# EAGLE schematic groovy (EAGLE 9.0.1)

## Sheet 1 of 2
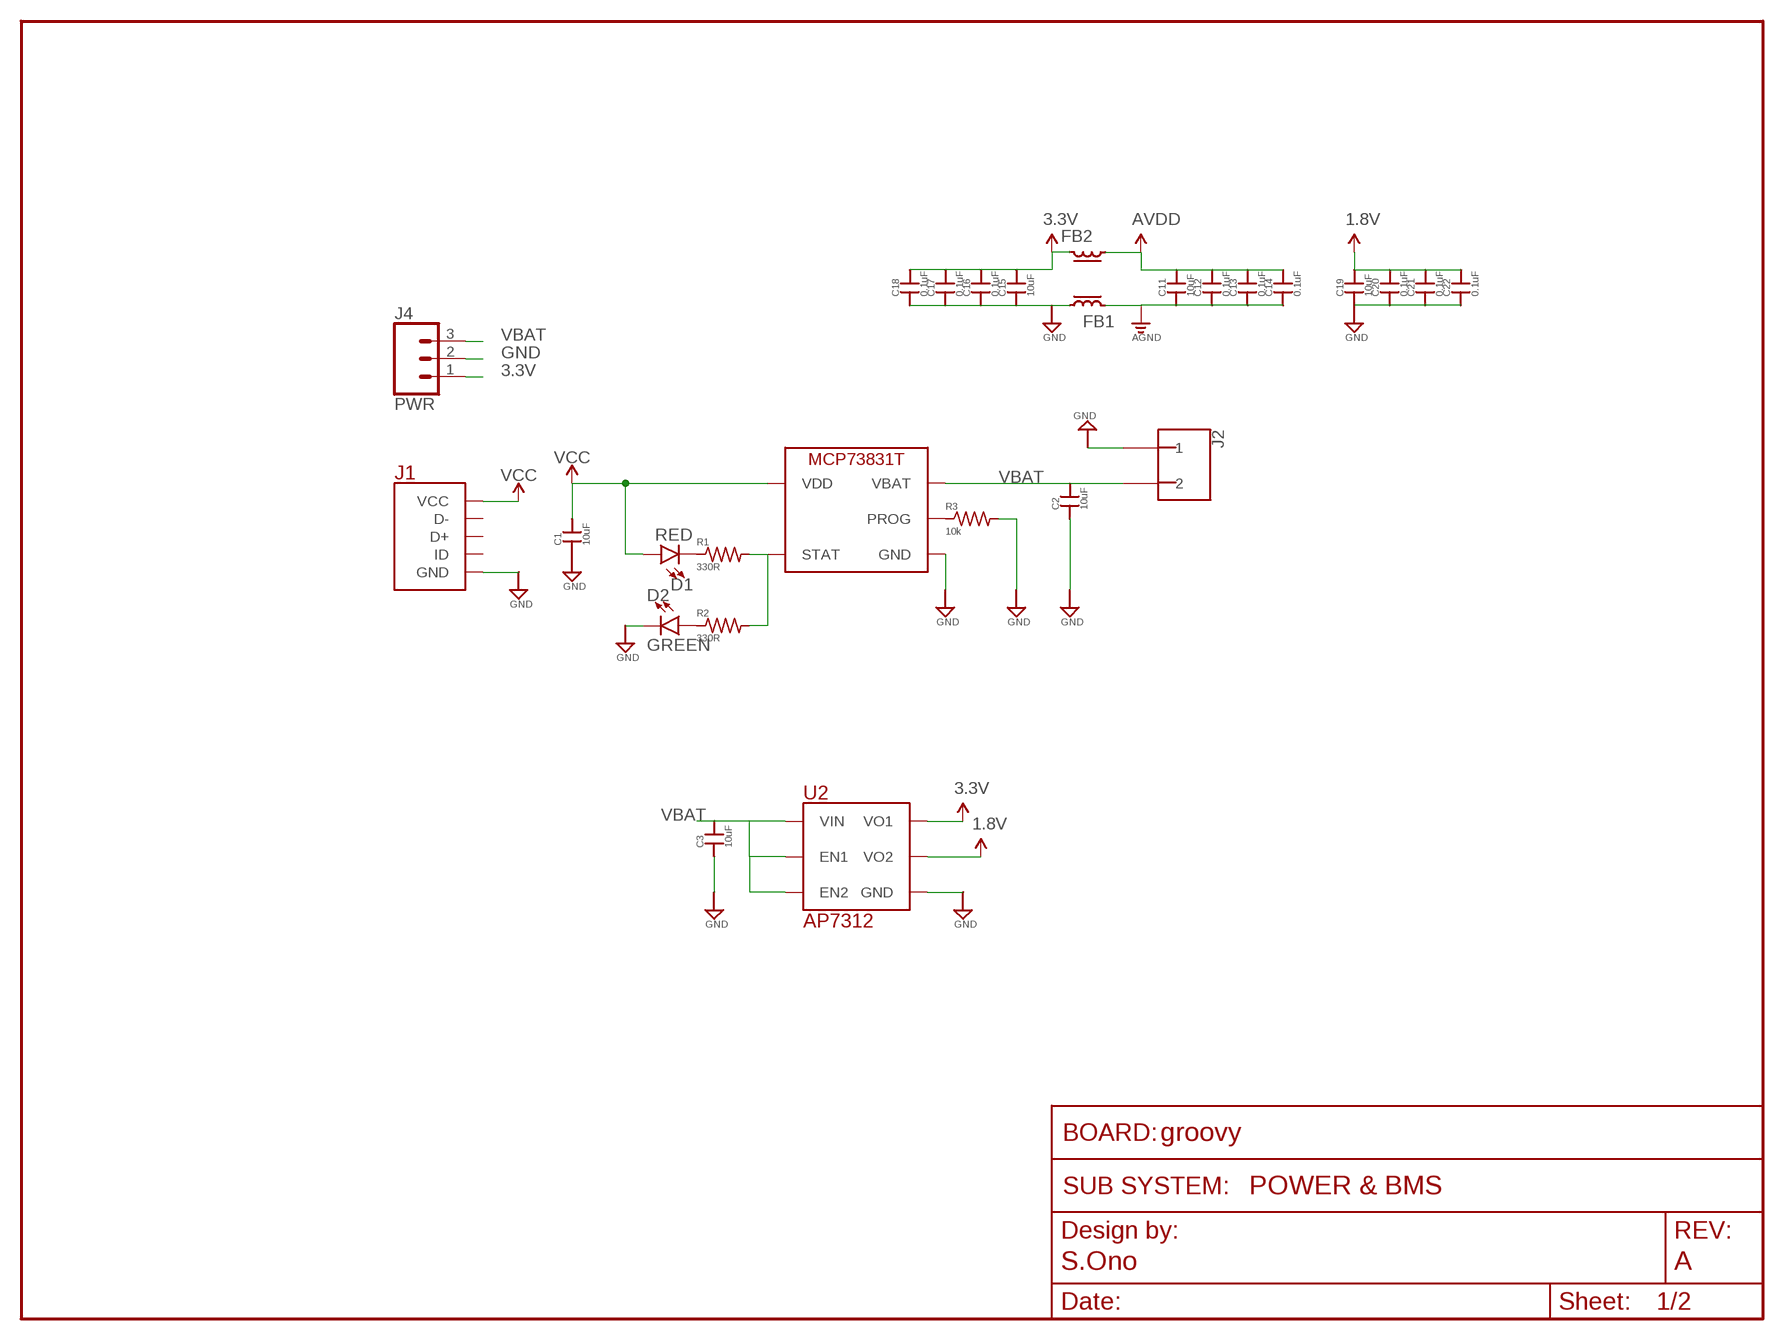
[diagram p0: schematic, sheet 1]
FRAME1 (FRAME_SCHEMATIC): AUTHOR: S.Ono; REV: A; SUBSYSTEM_NAME: POWER & BMS

### Parts
C1  10uF  CAP0402-CAP  [0402-CAP]
C2  10uF  CAP0402-CAP  [0402-CAP]
C3  10uF  CAP0402-CAP  [0402-CAP]
C11  10uF  CAP0402-CAP  [0402-CAP]
C12  0.1uF  CAP0402-CAP  [0402-CAP]
C13  0.1uF  CAP0402-CAP  [0402-CAP]
C14  0.1uF  CAP0402-CAP  [0402-CAP]
C15  10uF  CAP0402-CAP  [0402-CAP]
C16  0.1uF  CAP0402-CAP  [0402-CAP]
C17  0.1uF  CAP0402-CAP  [0402-CAP]
C18  0.1uF  CAP0402-CAP  [0402-CAP]
C19  10uF  CAP0402-CAP  [0402-CAP]
C20  0.1uF  CAP0402-CAP  [0402-CAP]
C21  0.1uF  CAP0402-CAP  [0402-CAP]
C22  0.1uF  CAP0402-CAP  [0402-CAP]
D1  RED  LED0603  [LED-0603]
D2  GREEN  LED0603  [LED-0603]
FB1  FERRITE  [0603-FERR]
FB2  FERRITE  [0603-FERR]
J1  USB_MICRO  [USB_MICRO]
J2  2_PIN_JST-XH  [2_PIN_JST-XH]
J4  PWR  CONN_03  [1X03]
R1  330R  R-US_R0603  [R0603]
R2  330R  R-US_R0603  [R0603]
R3  10k  R-US_R0603  [R0603]
U1  MCP73831T  [SOT23-5]
U2  AP7312-1833  [6-SOT]

### Nets
1.8V: C19.2 C20.2 C21.2 C22.2 U2.1(VO2) ; also sheet 2
3.3V: C15.2 C16.2 C17.2 C18.2 FB2.2 J4.1 U2.6(VO1) ; also sheet 2
AGND: C11.1 C12.1 C13.1 C14.1 FB1.2 ; also sheet 2
AVDD: C11.2 C12.2 C13.2 C14.2 FB2.1 ; also sheet 2
GND: C1.1 C2.1 C3.1 C15.1 C16.1 C17.1 C18.1 C19.1 C20.1 C21.1 C22.1 D2.C FB1.1 J1.GND J2.P$1 J4.2 R3.2 U1.2(GND) U2.2(GND) ; also sheet 2
N$1: D1.C R1.1
N$2: D2.A R2.1
N$4: R1.2 R2.2 U1.1(STAT)
N$5: R3.1 U1.5(PROG)
VBAT: C2.2 C3.2 J2.P$2 J4.3 U1.3(VBAT) U2.3(EN2) U2.4(EN1) U2.5(VIN)
VCC: C1.2 D1.A J1.VCC U1.4(VDD)
Unconnected: J1.D+ J1.D- J1.ID

## Sheet 2 of 2
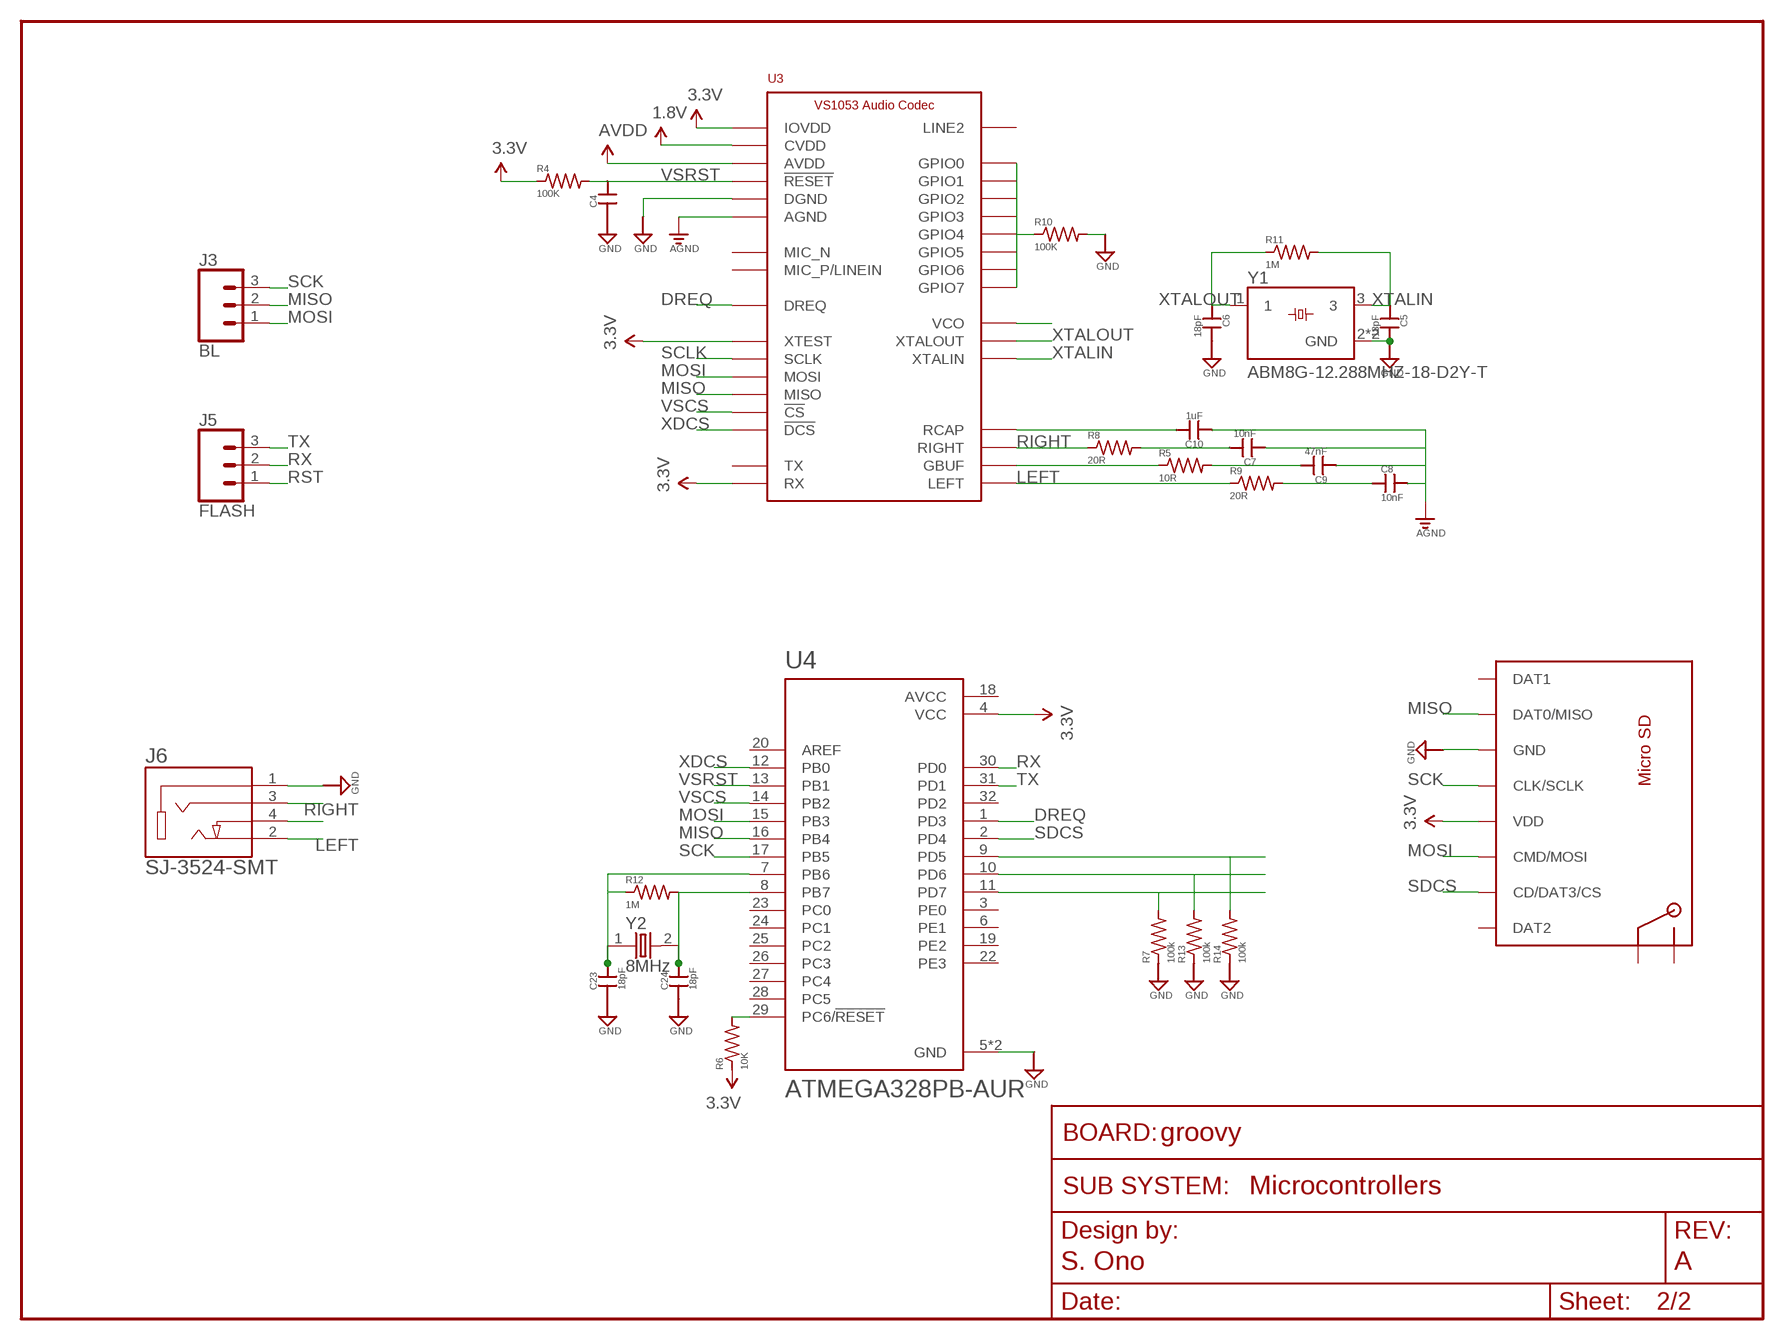
[diagram p1: schematic, sheet 2]
FRAME2 (FRAME_SCHEMATIC): AUTHOR: S. Ono; REV: A; SUBSYSTEM_NAME: Microcontrollers

### Parts
C4  CAP0603-CAP  [0603-CAP]
C5  18pF  CAP0603-CAP  [0603-CAP]
C6  18pF  CAP0603-CAP  [0603-CAP]
C7  10nF  CAP0603-CAP  [0603-CAP]
C8  10nF  CAP0603-CAP  [0603-CAP]
C9  47nF  CAP0603-CAP  [0603-CAP]
C10  1uF  CAP0603-CAP  [0603-CAP]
C23  18pF  CAP0603-CAP  [0603-CAP]
C24  18pF  CAP0603-CAP  [0603-CAP]
J3  BL  CONN_03  [1X03]
J5  FLASH  CONN_03  [1X03]
J6  SJ-3524-SMT  [CUI_SJ-3524-SMT]
P1  MICROSD  [MICROSD]
R4  100K  R-US_R0603  [R0603]
R5  10R  R-US_R0603  [R0603]
R6  10K  R-US_R0603  [R0603]
R7  100k  R-US_R0603  [R0603]
R8  20R  R-US_R0603  [R0603]
R9  20R  R-US_R0603  [R0603]
R10  100K  R-US_R0603  [R0603]
R11  1M  R-US_R0603  [R0603]
R12  1M  R-US_R0603  [R0603]
R13  100k  R-US_R0603  [R0603]
R14  100k  R-US_R0603  [R0603]
U3  VS1053  [QFP50P900X900X120-48N]
U4  ATMEGA328PB-AUR  [QFP80P900X900X120-32N]
Y1  ABM8G-12.288MHZ-18-D2Y-T  [OSCSC320X250X100N]
Y2  8MHz  ABM3-8.000MHZ-D2Y-T  [XTAL500X320X130N]

### Nets
1.8V: U3.5(CVDD) U3.7(CVDD) U3.24(CVDD) U3.31(CVDD) ; also sheet 1
3.3V: P1.4(VDD) R4.1 R6.1 U3.6(IOVDD) U3.14(IOVDD) U3.19(IOVDD) U3.26(RX) U3.32(XTEST) U4.4(VCC) ; also sheet 1
AGND: C7.1 C8.2 C9.1 C10.1 U3.37(AGND) U3.40(AGND) U3.41(AGND) U3.47(AGND) ; also sheet 1
AVDD: U3.38(AVDD) U3.43(AVDD) U3.45(AVDD) ; also sheet 1
DREQ: U3.8(DREQ) U4.1(PD3)
GBUF: R5.1 U3.42(GBUF)
GND: C4.1 C5.2 C6.2 C23.1 C24.1 J6.1 P1.6(GND) R7.1 R10.2 R13.1 R14.1 U3.4(DGND) U3.16(DGND) U3.20(DGND) U3.21(DGND) U3.22(DGND) U3.35(DGND) U4.5(GND) U4.21(GND) Y1.2(GND) Y1.4(GND) ; also sheet 1
LEFT: J6.2 R9.1 U3.46(LEFT)
MISO: J3.2 P1.7(DAT0/MISO) U3.30(MISO) U4.16(PB4)
MOSI: J3.1 P1.3(CMD/MOSI) U3.29(MOSI) U4.15(PB3)
N$3: C7.2 R8.2
N$6: C23.2 R12.1 U4.7(PB6) Y2.1
N$7: R7.2 U4.11(PD7)
N$8: C24.2 R12.2 U4.8(PB7) Y2.2
N$9: R13.2 U4.10(PD6)
N$10: J6.4
N$11: R14.2 U4.9(PD5)
N$23: U3.15(VCO)
N$24: C9.2 R5.2
N$25: C8.1 R9.2
N$27: R10.1 U3.9(GPIO2) U3.10(GPIO3) U3.11(GPIO6) U3.12(GPIO7) U3.25(GPIO5) U3.33(GPIO0) U3.34(GPIO1) U3.36(GPIO4)
RCAP: C10.2 U3.44(RCAP)
RIGHT: J6.3 R8.1 U3.39(RIGHT)
RST: J5.1 R6.2 U4.29(PC6/!RESET)
RX: J5.2 U4.30(PD0)
SCK: J3.3 P1.5(CLK/SCLK) U4.17(PB5)
SCLK: U3.28(SCLK)
SDCS: P1.2(CD/DAT3/CS) U4.2(PD4)
TX: J5.3 U4.31(PD1)
VSCS: U3.23(!CS!) U4.14(PB2)
VSRST: C4.2 R4.2 U3.3(!RESET!) U4.13(PB1)
XDCS: U3.13(!DCS!) U4.12(PB0)
XTALIN: C5.1 R11.2 U3.18(XTALIN) Y1.3
XTALOUT: C6.1 R11.1 U3.17(XTALOUT) Y1.1
Unconnected: P1.1(DAT2) P1.8(DAT1) P1.DETECT1(DET0) P1.DETECT2(DET1) U3.1(MIC_P/LINEIN) U3.2(MIC_N) U3.27(TX) U3.48(LINE2) U4.3(PE0) U4.6(PE1) U4.19(PE2) U4.20(AREF) U4.22(PE3) U4.23(PC0) U4.24(PC1) U4.25(PC2) U4.26(PC3) U4.27(PC4) U4.28(PC5) U4.32(PD2)

## Power pins joined to a net without a drawn wire
AVCC: U4.18(AVCC)

## Library data of the parts
C1-C24 = scono:CAP: Capacitor Standard 0603 ceramic capacitor, and 0.1" leaded capacitor.; PIE-INT-REF-NUM: CAPACITOR-GENERIC
D1 D2 = scono:LED: https://www.digikey.com/products/en/optoelectronics/led-indication-discrete/105?k=&pkeyword=&pv7=2&pv1989=0&pv16=5&FV=ffe00069&quantity=0&ColumnSort=0&page=1&pageSize=25
FB1 FB2 = scono:FERRITE: https://www.digikey.com/product-detail/en/wurth-electronics-inc/742792651/732-1593-1-ND/1639537
J1 = scono:USB_MICRO: https://www.digikey.com/product-detail/en/molex-llc/0475890001/WM17143CT-ND/1832255
J2 = scono:2_PIN_JST-XH: https://www.digikey.com/product-detail/en/jst-sales-america-inc/B2B-XH-A(LF)(SN)/455-2247-ND/1651045
J3-J5 = scono:CONN_03: Multi connection point. Often used as Generic Header-pin footprint for 0.1 inch spaced/style header connections On any of the 0.1 inch spaced packages, you can populate with these: Break Away Headers - Straight <https://www.sparkfun.com/products/116> (PRT-00116) Break Away Male Headers - Right Angle <https://www.sparkfun.com/products/553> (PRT-00553) Female Headers <https://www.sparkfun.com/products/115> (PRT-00115) Break Away Headers - Machine Pin <https://www.sparkfun.com/products/117> (PRT-00117) Break Away Female Headers - Swiss Machine Pin <https://www.sparkfun.com/products/743> (PRT-00743) Stackable Header - 3 Pin (Female, 0.1") <https://www.sparkfun.com/products/13875> (PRT-13875) For SCREWTERMINALS and SPRING TERMINALS visit here: Screw Terimnals on SparkFun.com <https://www.sparkfun.com/search/results?term=Screw+Terminals> (5mm/3.5mm/2.54mm spacing) This device is also useful as a general connection point to wire up your design to another part of your project. Our various solder wires solder well into these plated through hole pads. Hook-Up Wire - Assortment (Stranded, 22 AWG) <https://www.sparkfun.com/products/11375> (PRT-11375) Hook-Up Wire - Assortment (Solid Core, 22 AWG) <https://www.sparkfun.com/products/11367> (PRT-11367) View the entire wire category on our website here <https://www.sparkfun.com/categories/141> Special notes: Molex polarized connector foot print use with SKU : PRT-08232 with associated crimp pins and housings.
J6 = scono:SJ-3524-SMT: Audio Jack Connector 3.5 mm Low Profile Surface Mount Stereo Jack, 4 Pin Right-Angle; CUI_PURCHASE_URL: https://www.cui.com/product/interconnect/audio-connectors/3.5-mm-jacks/sj-352x-smt-series?utm_source=snapeda.com&utm_medium=referral&utm_campaign=snapedaBOM; DESCRIPTION: SJ Series 3.5 mm 12 V SMT Right Angle Stereo Audio Jack; DIGI-KEY_PART_NUMBER: CP-3524SJCT-ND; DIGI-KEY_PURCHASE_URL: https://www.digikey.com/product-detail/en/cui-inc/SJ-3524-SMT-TR/CP-3524SJCT-ND/669705?utm_source=snapeda&utm_medium=aggregator&utm_campaign=symbol; MF: CUI Inc.; MP: SJ-3524-SMT-TR; PACKAGE: None
P1 = scono:MICROSD: https://www.digikey.com/product-detail/en/molex-llc/1040310811/WM6357CT-ND/2804769
R1-R14 = scono:R-US_: RESISTOR, American symbol; DESCRIPTION: RESISTOR, American symbol; DISTRIBUTOR: DigiKey; MANUFACTURER: Rohm Semiconductor; NOTES: Cut Tape; PACKAGE: R0603
U1 = scono:MCP73831T: https://www.digikey.com/product-detail/en/microchip-technology/MCP73831T-2ACI-OT/MCP73831T-2ACI-OTCT-ND/1979802
U2 = scono:AP7312-1833: https://www.digikey.com/product-detail/en/diodes-incorporated/AP7312-1833W6-7/AP7312-1833W6-7DICT-ND/2901064
U3 = scono:VS1053: https://www.digikey.com/product-detail/en/adafruit-industries-llc/1681/1528-2645-ND/
U4 = scono:ATMEGA328PB-AUR: ATmega Series 20 MHz 32 KB Flash 2 KB SRAM 8-Bit Microcontroller - TQFP-32; DESCRIPTION: AVR microcontroller; EEPROM: 1024B; SRAM: 2kB; Flash: 32kB; TQFP32; DIGI-KEY_PART_NUMBER: ATMEGA328PB-AURCT-ND; DIGI-KEY_PURCHASE_URL: https://www.digikey.com/product-detail/en/microchip-technology/ATMEGA328PB-AUR/ATMEGA328PB-AURCT-ND/5722706?utm_source=snapeda&utm_medium=aggregator&utm_campaign=symbol; MF: Microchip; MP: ATMEGA328PB-AUR; PACKAGE: TQFP-32 Microchip
Y1 = scono:ABM8G-12.288MHZ-18-D2Y-T: Crystal 20MHz Â±20ppm (Tol) Â±30ppm (Stability) 18pF FUND 80Ohm 4-Pin Mini-CSMD T/R; DESCRIPTION: Crystal 12.288MHz Â±20ppm _Tol_ Â±30ppm _Stability_ 18pF FUND 80Ohm 4-Pin Mini-CSMD T/R; DIGI-KEY_PART_NUMBER: 535-10262-1-ND; DIGI-KEY_PURCHASE_URL: https://www.digikey.com/product-detail/en/abracon-llc/ABM8G-12.288MHZ-18-D2Y-T/535-10262-1-ND/2218075?utm_source=snapeda&utm_medium=aggregator&utm_campaign=symbol; MF: Abracon; MP: ABM8G-12.288MHZ-18-D2Y-T; PACKAGE: SMD-4 Abracon
Y2 = scono:ABM3-8.000MHZ-D2Y-T: Crystals 12MHz 18pF 30ppm -40C +85C; DESCRIPTION: Crystal 8MHz Ø·Â¢Ø¢Â±20ppm _Tol_ Ø·Â¢Ø¢Â±30ppm _Stability_ 18pF FUND 500Ohm 2-Pin CSMD T/R; DIGI-KEY_PART_NUMBER: 535-10630-1-ND; DIGI-KEY_PURCHASE_URL: https://www.digikey.com/product-detail/en/abracon-llc/ABM3-8.000MHZ-D2Y-T/535-10630-1-ND/2344632?utm_source=snapeda&utm_medium=aggregator&utm_campaign=symbol; MF: Abracon; MP: ABM3-8.000MHZ-D2Y-T; PACKAGE: SMD-2 Abracon